# Altium schematic sheet HUB-USB.SchDoc
size 381 x 241 mm; SheetNumber: 2; SheetTotal: 2; SPICEModelCacheYWGEYEZR: <root> / <DocumentId>YWGEYEZR</DocumentId> / </root>
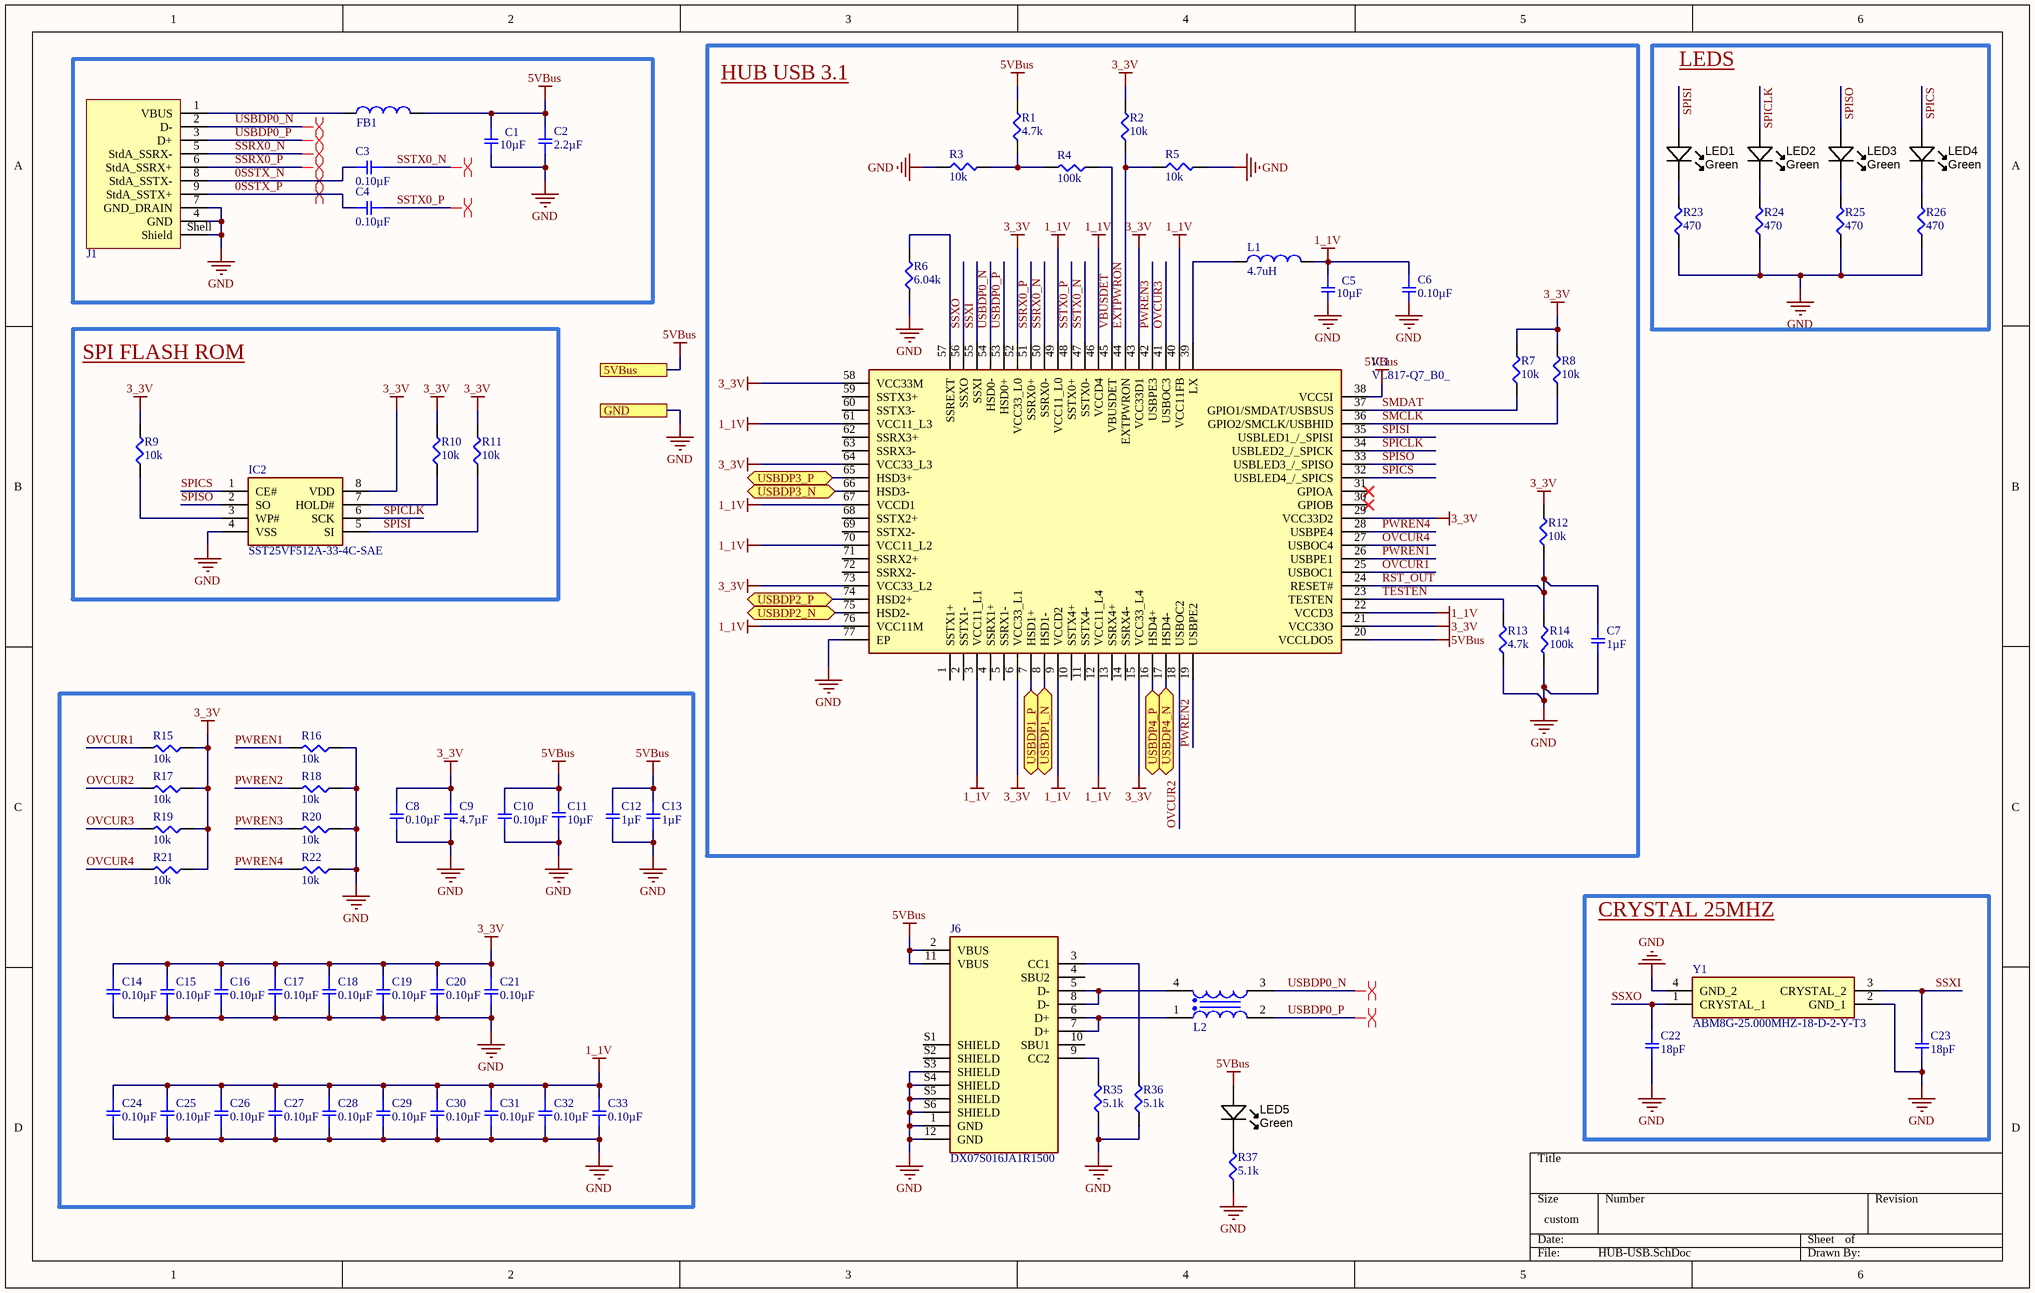
[diagram p0: HUB-USB.SchDoc]

## Parts
C1  10µF  [SMD-0603C]
C2  2.2µF  [SMD-0603C]
C3  0.10µF  [SMD-0402C]
C4  0.10µF  [SMD-0402C]
C5  10µF  [SMD-0603C]
C6  0.10µF  [SMD-0402C]
C7  1µF  [SMD-0402C]
C8  0.10µF  [SMD-0402C]
C9  4.7µF  [SMD-0402C]
C10  0.10µF  [SMD-0402C]
C11  10µF  [SMD-0805C]
C12  1µF  [SMD-0402C]
C13  1µF  [SMD-0402C]
C14  0.10µF  [SMD-0402C]
C15  0.10µF  [SMD-0402C]
C16  0.10µF  [SMD-0402C]
C17  0.10µF  [SMD-0402C]
C18  0.10µF  [SMD-0402C]
C19  0.10µF  [SMD-0402C]
C20  0.10µF  [SMD-0402C]
C21  0.10µF  [SMD-0402C]
C22  18pF  [SMD-0402C]
C23  18pF  [SMD-0402C]
C24  0.10µF  [SMD-0402C]
C25  0.10µF  [SMD-0402C]
C26  0.10µF  [SMD-0402C]
C27  0.10µF  [SMD-0402C]
C28  0.10µF  [SMD-0402C]
C29  0.10µF  [SMD-0402C]
C30  0.10µF  [SMD-0402C]
C31  0.10µF  [SMD-0402C]
C32  0.10µF  [SMD-0402C]
C33  0.10µF  [SMD-0402C]
FB1  10Ohm  [WE-CBA_0402_L1W0.5H0.5_HC]  (value not drawn)
IC1  VL817-Q7_B0_  [QFN40P900X900X90-77N-D]
IC2  SST25VF512A-33-4C-SAE  [SOIC127P600X175-8N]
J1  692122030100  [692122030100]  (value not drawn)
J6  DX07S016JA1R1500  [JAE_DX07S016JA1R1500]
L1  4.7uH  [INDC2518X200N]
L2  90Ohm  [WE-CNSW_1206]  (value not drawn)
LED1  Green  [LED-0603-GREEN]
LED2  Green  [LED-0603-GREEN]
LED3  Green  [LED-0603-GREEN]
LED4  Green  [LED-0603-GREEN]
LED5  Green  [LED-0603-GREEN]
R1  4.7k  [SMD-0402-RES]
R2  10k  [SMD-0402-RES]
R3  10k  [SMD-0402-RES]
R4  100k  [SMD-0402-RES]
R5  10k  [SMD-0402-RES]
R6  6.04k  [SMD-0402-RES]
R7  10k  [SMD-0402-RES]
R8  10k  [SMD-0402-RES]
R9  10k  [SMD-0402-RES]
R10  10k  [SMD-0402-RES]
R11  10k  [SMD-0402-RES]
R12  10k  [SMD-0402-RES]
R13  4.7k  [SMD-0402-RES]
R14  100k  [SMD-0402-RES]
R15  10k  [SMD-0402-RES]
R16  10k  [SMD-0402-RES]
R17  10k  [SMD-0402-RES]
R18  10k  [SMD-0402-RES]
R19  10k  [SMD-0402-RES]
R20  10k  [SMD-0402-RES]
R21  10k  [SMD-0402-RES]
R22  10k  [SMD-0402-RES]
R23  470  [SMD-0402-RES]
R24  470  [SMD-0402-RES]
R25  470  [SMD-0402-RES]
R26  470  [SMD-0402-RES]
R35  5.1k  [SMD-0603-RES]
R36  5.1k  [SMD-0603-RES]
R37  5.1k  [SMD-0603-RES]
Y1  ABM8G-25.000MHZ-18-D-2-Y-T3  [ABM8G16000MHZB4YT]

## Blocks framed on the sheet
HUB USB 3.1: C5-C7 IC1 L1 R1-R8 R12-R14
LEDS: LED1-LED4 R23-R26
SPI FLASH ROM: IC2 R9-R11
CRYSTAL 25MHZ: C22 C23 Y1

## Ports
5VBus (see DSD_Aerobits_RPI4_OLED[3A]), GND (see DSD_Aerobits_RPI4_OLED[3B]), USBDP1_N (bidir, see DSD_Aerobits_RPI4_OLED[3B]), USBDP1_P (bidir, see DSD_Aerobits_RPI4_OLED[3B]), USBDP2_N (bidir, see DSD_Aerobits_RPI4_OLED[3B]), USBDP2_P (bidir, see DSD_Aerobits_RPI4_OLED[3B]), USBDP3_N (bidir, see DSD_Aerobits_RPI4_OLED[3A]), USBDP3_P (bidir, see DSD_Aerobits_RPI4_OLED[3A]), USBDP4_N (bidir, see DSD_Aerobits_RPI4_OLED[3B]), USBDP4_P (bidir, see DSD_Aerobits_RPI4_OLED[3B])

## Nets
1_1V: C5.1 C6.1 C24.1 C25.1 C26.1 C27.1 C28.1 C29.1 C30.1 C31.1 C32.1 C33.1 IC1.3(VCC11_L1) IC1.9(VCCD2) IC1.12(VCC11_L4) IC1.22(VCCD3) IC1.40(VCC11FB) IC1.46(VCCD4) IC1.49(VCC11_L0) IC1.61(VCC11_L3) IC1.67(VCCD1) IC1.70(VCC11_L2) IC1.76(VCC11M) L1.2
3_3V: C8.1 C9.1 C14.1 C15.1 C16.1 C17.1 C18.1 C19.1 C20.1 C21.1 IC1.6(VCC33_L1) IC1.15(VCC33_L4) IC1.21(VCC33O) IC1.29(VCC33D2) IC1.43(VCC33D1) IC1.52(VCC33_L0) IC1.58(VCC33M) IC1.64(VCC33_L3) IC1.73(VCC33_L2) IC2.8(VDD) R2.2 R7.2 R8.2 R9.2 R10.2 R11.2 R12.2 R15.1 R17.1 R19.1 R21.1
5VBus: C1.1 C2.1 C10.1 C11.2 C12.1 C13.1 FB1.2 IC1.20(VCCLDO5) IC1.38(VCC5I) J6.2(VBUS) J6.11(VBUS) LED5.A R1.2 ; port 5VBus
GND: C1.2 C2.2 C5.2 C6.2 C7.2 C8.2 C9.2 C10.2 C11.1 C12.2 C13.2 C14.2 C15.2 C16.2 C17.2 C18.2 C19.2 C20.2 C21.2 C22.2 C23.2 C24.2 C25.2 C26.2 C27.2 C28.2 C29.2 C30.2 C31.2 C32.2 C33.2 IC1.77(EP) IC2.4(VSS) J1.4(GND) J1.7(GND_DRAIN) J1.Shell(Shield) J6.1(GND) J6.12(GND) J6.S3(SHIELD) J6.S4(SHIELD) J6.S5(SHIELD) J6.S6(SHIELD) R3.1 R5.2 R6.1 R13.1 R14.2 R16.1 R18.1 R20.1 R22.1 R23.1 R24.1 R25.1 R26.1 R35.1 R36.1 R37.1 Y1.2(GND_1) Y1.4(GND_2) ; port GND
0SSTX_N: C3.2 J1.8(StdA_SSTX-)
0SSTX_P: C4.2 J1.9(StdA_SSTX+)
EXTPWRON: IC1.44(EXTPWRON) R2.1 R5.1
OVCUR1: IC1.25(USBOC1) R15.2
OVCUR2: IC1.18(USBOC2) R17.2
OVCUR3: IC1.41(USBOC3) R19.2
OVCUR4: IC1.27(USBOC4) R21.2
PWREN1: IC1.26(USBPE1) R16.2
PWREN2: IC1.19(USBPE2) R18.2
PWREN3: IC1.42(USBPE3) R20.2
PWREN4: IC1.28(USBPE4) R22.2
RST_OUT: C7.1 IC1.24(RESET#) R12.1 R14.1
SMCLK: IC1.36(GPIO2/SMCLK/USBHID) R8.1
SMDAT: IC1.37(GPIO1/SMDAT/USBSUS) R7.1
SPICLK: IC1.34(USBLED2_/_SPICK) IC2.6(SCK) LED2.A
SPICS: IC1.32(USBLED4_/_SPICS) IC2.1(CE#) LED4.A
SPISI: IC1.35(USBLED1_/_SPISI) IC2.5(SI) LED1.A R11.1
SPISO: IC1.33(USBLED3_/_SPISO) IC2.2(SO) LED3.A
SSRX0_N: IC1.50(SSRX0-) J1.5(StdA_SSRX-)
SSRX0_P: IC1.51(SSRX0+) J1.6(StdA_SSRX+)
SSTX0_N: C3.1 IC1.47(SSTX0-)
SSTX0_P: C4.1 IC1.48(SSTX0+)
SSXI: C23.1 IC1.55(SSXI) Y1.3(CRYSTAL_2)
SSXO: C22.1 IC1.56(SSXO) Y1.1(CRYSTAL_1)
TESTEN: IC1.23(TESTEN) R13.2
USBDP0_N: IC1.54(HSD0-) J1.2(D-) L2.3
USBDP0_P: IC1.53(HSD0+) J1.3(D+) L2.2
USBDP1_N: IC1.8(HSD1-) ; port USBDP1_N
USBDP1_P: IC1.7(HSD1+) ; port USBDP1_P
USBDP2_N: IC1.75(HSD2-) ; port USBDP2_N
USBDP2_P: IC1.74(HSD2+) ; port USBDP2_P
USBDP3_N: IC1.66(HSD3-) ; port USBDP3_N
USBDP3_P: IC1.65(HSD3+) ; port USBDP3_P
USBDP4_N: IC1.17(HSD4-) ; port USBDP4_N
USBDP4_P: IC1.16(HSD4+) ; port USBDP4_P
VBUSDET: IC1.45(VBUSDET) R4.1
NetFB1_1: FB1.1 J1.1(VBUS)
NetIC1_39: IC1.39(LX) L1.1
NetIC1_57: IC1.57(SSREXT) R6.2
NetIC2_3: IC2.3(WP#) R9.1
NetIC2_7: IC2.7(HOLD#) R10.1
NetJ6_3: J6.3(CC1) R36.2
NetJ6_5: J6.5(D-) J6.8(D-) L2.4
NetJ6_6: J6.6(D+) J6.7(D+) L2.1
NetJ6_9: J6.9(CC2) R35.2
NetLED1_K: LED1.K R23.2
NetLED2_K: LED2.K R24.2
NetLED3_K: LED3.K R25.2
NetLED4_K: LED4.K R26.2
NetLED5_K: LED5.K R37.2
NetR1_1: R1.1 R3.2 R4.2

Not connected (* = marked no-connect by the designer): IC1 1(SSTX1+) 2(SSTX1-) 4(SSRX1+) 5(SSRX1-) 10(SSTX4+) 11(SSTX4-) 13(SSRX4+) 14(SSRX4-) 30(GPIOB)* 31(GPIOA)* 59(SSTX3+) 60(SSTX3-) 62(SSRX3+) 63(SSRX3-) 68(SSTX2+) 69(SSTX2-) 71(SSRX2+) 72(SSRX2-); J6 4(SBU2) 10(SBU1) S1(SHIELD) S2(SHIELD)

## Layout directives
differential pair: 0SSTX_N, 0SSTX_P, SSRX0_N, SSRX0_P, SSTX0_N, SSTX0_P, USBDP0_N, USBDP0_P

## Library data of the parts
C1 C5 = GRT188C81C106ME13D: CAP CER 10UF 16V X6S 0603; Manufacturer: Murata Electronics North America; Factory Stock: 0; Unit Price (USD): 0,46; Minimum Quantity: 1; Tolerance: ±20%; Part Number: GRT188C81C106ME13D; Datasheets: http://search.murata.co.jp/Ceramy/image/img/A01X/G101/ENG/GRT188C81C106ME13-01.pdf; Image: //media.digikey.com/Renders/Murata%20Renders/0603%28LQG18%29.jpg; Digi-Key Part Number: 490-12286-1-ND; Quantity Available: 5439; @ qty: 0; Packaging: Cut Tape (CT); Series: GRT; Part Status: Active; Value: 10µF; Voltage: 16V; Temperature Coefficient: X6S; Operating Temperature: -55°C ~ 105°C; Features: -; Ratings: AEC-Q200; Applications: Automotive; Mounting Type: Surface Mount, MLCC; Package / Case: 0603 (1608 Metric); Size / Dimension: 0.063" L x 0.031" W (1.60mm x 0.80mm); Height - Seated (Max): -; Thickness (Max): 0.035" (0.90mm); Lead Spacing: -; Lead Style: -
C2 = GRT188C81C225KE13D: CAP CER 2.2UF 16V X6S 0603; Manufacturer: Murata Electronics North America; Factory Stock: 0; Unit Price (USD): 0,21; Minimum Quantity: 1; Tolerance: ±10%; Part Number: GRT188C81C225KE13D; Datasheets: http://search.murata.co.jp/Ceramy/image/img/A01X/G101/ENG/GRT188C81C225KE13-01.pdf; Image: //media.digikey.com/Renders/Murata%20Renders/0603%28LQG18%29.jpg; Digi-Key Part Number: 490-12287-1-ND; Quantity Available: 5939; @ qty: 0; Packaging: Cut Tape (CT); Series: GRT; Part Status: Active; Value: 2.2µF; Voltage: 16V; Temperature Coefficient: X6S; Operating Temperature: -55°C ~ 105°C; Features: -; Ratings: AEC-Q200; Applications: Automotive; Mounting Type: Surface Mount, MLCC; Package / Case: 0603 (1608 Metric); Size / Dimension: 0.063" L x 0.031" W (1.60mm x 0.80mm); Height - Seated (Max): -; Thickness (Max): 0.035" (0.90mm); Lead Spacing: -; Lead Style: -
C3 C4 C6 C8 C10 C14-C21 C24-C33 = GCM155R71C104KA55J: CAP CER 0.1UF 16V X7R 0402; Manufacturer: Murata Electronics North America; Factory Stock: 0; Unit Price (USD): 0,1; Minimum Quantity: 1; Tolerance: ±10%; Part Number: GCM155R71C104KA55J; Datasheets: http://www.murata.com/~/media/webrenewal/support/library/catalog/products/capacitor/mlcc/c03e.ashx; Image: //media.digikey.com/Renders/Murata%20Renders/ZRB-SERIES-0402.jpg; Digi-Key Part Number: 490-7998-1-ND; Quantity Available: 618705; @ qty: 0; Packaging: Cut Tape (CT); Series: GCM; Part Status: Active; Value: 0.10µF; Voltage: 16V; Temperature Coefficient: X7R; Operating Temperature: -55°C ~ 125°C; Features: -; Ratings: AEC-Q200; Applications: Automotive; Mounting Type: Surface Mount, MLCC; Package / Case: 0402 (1005 Metric); Size / Dimension: 0.039" L x 0.020" W (1.00mm x 0.50mm); Height - Seated (Max): -; Thickness (Max): 0.022" (0.55mm); Lead Spacing: -; Lead Style: -
C7 C12 C13 = GRM155R61E105MA12D: CAP CER 1UF 25V X5R 0402; Manufacturer: Murata Electronics North America; Factory Stock: 0; Unit Price (USD): 0,1; Minimum Quantity: 1; Tolerance: ±20%; Part Number: GRM155R61E105MA12D; Datasheets: http://www.murata.com/~/media/webrenewal/support/library/catalog/products/capacitor/mlcc/c02e.pdf; Image: //media.digikey.com/Renders/Murata%20Renders/ZRB-SERIES-0402.jpg; Digi-Key Part Number: 490-10018-1-ND; Quantity Available: 32609; @ qty: 0; Packaging: Cut Tape (CT); Series: GRM; Part Status: Active; Value: 1µF; Voltage: 25V; Temperature Coefficient: X5R; Operating Temperature: -55°C ~ 85°C; Features: Derating Recommended; Ratings: -; Applications: General Purpose; Mounting Type: Surface Mount, MLCC; Package / Case: 0402 (1005 Metric); Size / Dimension: 0.039" L x 0.020" W (1.00mm x 0.50mm); Height - Seated (Max): -; Thickness (Max): 0.022" (0.55mm); Lead Spacing: -; Lead Style: -
C9 = ZRB15XR61A475KE01D: CAP CER 4.7UF 10V X5R 0402; Manufacturer: Murata Electronics North America; Factory Stock: 0; Unit Price (USD): 0,28; Minimum Quantity: 1; Tolerance: ±10%; Part Number: ZRB15XR61A475KE01D; Datasheets: http://search.murata.co.jp/Ceramy/image/img/A01X/G101/ENG/ZRB15XR61A475KE01-01.pdf; Image: //media.digikey.com/Renders/Murata%20Renders/ZRB-SERIES-0402.jpg; Digi-Key Part Number: 490-13252-1-ND; Quantity Available: 23076; @ qty: 0; Packaging: Cut Tape (CT); Series: ZRB; Part Status: Active; Value: 4.7µF; Voltage: 10V; Temperature Coefficient: X5R; Operating Temperature: -55°C ~ 85°C; Features: Derating Recommended, Interposer Termination; Ratings: -; Applications: Acoustic Noise Reduction; Mounting Type: Surface Mount, MLCC; Package / Case: 0402 (1005 Metric); Size / Dimension: 0.039" L x 0.020" W (1.00mm x 0.50mm); Height - Seated (Max): -; Thickness (Max): 0.031" (0.80mm); Lead Spacing: -; Lead Style: -
C11 = GRT21BC81C106KE01L: CAP CER 10UF 16V X6S 0805; Manufacturer: Murata Electronics North America; Factory Stock: 0; Unit Price (USD): 0,54; Minimum Quantity: 1; Tolerance: ±10%; Part Number: GRT21BC81C106KE01L; Datasheets: http://search.murata.co.jp/Ceramy/image/img/A01X/G101/ENG/GRT21BC81C106KE01-01.pdf; Image: //media.digikey.com/Renders/Murata%20Renders/GRT%20Series%200805(2012%20Metric).jpg; Digi-Key Part Number: 490-12343-1-ND; Quantity Available: 4300; @ qty: 0; Packaging: Cut Tape (CT); Series: GRT; Part Status: Active; Value: 10µF; Voltage: 16V; Temperature Coefficient: X6S; Operating Temperature: -55°C ~ 105°C; Features: Derating Recommended; Ratings: AEC-Q200; Applications: Automotive; Mounting Type: Surface Mount, MLCC; Package / Case: 0805 (2012 Metric); Size / Dimension: 0.079" L x 0.049" W (2.00mm x 1.25mm); Height - Seated (Max): -; Thickness (Max): 0.057" (1.45mm); Lead Spacing: -; Lead Style: -
C22 C23 = GRM1555C1E180JA01D: CAP CER 18PF 25V NP0 0402; Manufacturer: Murata Electronics North America; Factory Stock: 0; Unit Price (USD): 0,1; Minimum Quantity: 1; Tolerance: ±5%; Temperature Coefficient: C0G, NP0; Part Number: GRM1555C1E180JA01D; Datasheets: http://www.murata.com/~/media/webrenewal/support/library/catalog/products/capacitor/mlcc/c02e.pdf; Image: //media.digikey.com/Renders/Murata%20Renders/ZRB-SERIES-0402.jpg; Digi-Key Part Number: 490-6172-1-ND; Quantity Available: 78161; @ qty: 0; Packaging: Cut Tape (CT); Series: GRM; Part Status: Active; Value: 18pF; Voltage: 25V; Operating Temperature: -55°C ~ 125°C; Features: -; Ratings: -; Applications: General Purpose; Mounting Type: Surface Mount, MLCC; Package / Case: 0402 (1005 Metric); Size / Dimension: 0.039" L x 0.020" W (1.00mm x 0.50mm); Height - Seated (Max): -; Thickness (Max): 0.022" (0.55mm); Lead Spacing: -; Lead Style: -
FB1 = 782423100: WE-CBA SMT EMI Suppression Ferrite Bead, size 0402, 10Ohm, 1.5A; Manufacturer: Wurth Elektronik; Case/Size Code: 0402; DC Resistance Max: 0.03Ohm; Impedance Max: 17Ohm; Type: High Current; Manufacturer Part Number: 782423100; Category: Ferrites for PCB Assembly; Match Code: WE-CBA; ComponentLink1Description: Website Link; ComponentLink1URL: https://www.we-online.com/redexpert/article/782423100?ad; ComponentLink2Description: Datasheet Link; ComponentLink2URL: https://www.we-online.com/redexpert/spec/782423100?ad; Mount: Surface Mount; Operating Temperature Max: 125°C; Operating Temperature Min: -55°C; Packaging: Tape and Reel; Length: 1mm; Width: 0.5mm; Height: 0.5mm; Automotive: Yes; Impedance @100MHz: 10Ohm; Rated Current: 1.5A
IC1 = VL817-Q7_B0_: Integrated Circuit; Manufacturer_Name: VIA; Manufacturer_Part_Number: VL817-Q7(B0); Datasheet Link: https://item.szlcsc.com/210703.html; Height: 0.9mm
IC2 = SST25VF512A-33-4C-SAE: Integrated Circuit; Manufacturer_Name: Microchip; Datasheet Link: http://ww1.microchip.com/downloads/en/DeviceDoc/25090A.pdf; Height: 1.75mm; Manufacturer_Part_Number: SST25VF512A-33-4C-SAE; Mouser Part Number: 804-25VF512A3CSAE; Mouser Price/Stock: https://www.mouser.co.uk/ProductDetail/Microchip-Technology/SST25VF512A-33-4C-SAE?qs=sPPKN8MmjErx4W822Eh6pg%3D%3D; Arrow Part Number: SST25VF512A-33-4C-SAE; Arrow Price/Stock: https://www.arrow.com/en/products/sst25vf512a-33-4c-sae/microchip-technology?region=nac
J1 = 692122030100: WR-COM USB 3.0 Type A Horizontal SMT; Manufacturer: Wurth Elektronik; Match Code: WR-USB; Gender: Receptacle; Interface Type: Type A; Number of Ports: 1; Rated Current: 1.8A; Working Voltage: 30V (AC); Manufacturer Part Number: 692122030100; Category: Input/Output Connectors; ComponentLink1Description: Website Link; ComponentLink1URL: https://www.we-online.com/redexpert/article/692122030100?ad; ComponentLink2Description: Datasheet Link; ComponentLink2URL: https://www.we-online.com/redexpert/spec/692122030100?ad; Mount: Surface Mount; Operating Temperature Max: 85°C; Operating Temperature Min: -20°C; Packaging: Tape and Reel; Application: USB 3.0; Number of Pins: 9; Orientation: Horizontal
J6 = DX07S016JA1R1500: USB-C (USB TYPE-C) USB 2.0 Receptacle Connector 24 (16+8 Dummy) Position Surface Mount, Right Angle; Through Hole; Package: None; Value: *; Price: None; MP: DX07S016JA1R1500; Availability: Unavailable
L1 = CB2518T4R7M: Ind Power Chip Wirewound 4.7uH 20% 7.96MHz Ferrite 1.1A 1007 T/R; Price: None; MP: CB2518T4R7M; Value: *; Availability: Unavailable; Package: None
L2 = 744232090: WE-CNSW SMT Common Mode Line Filter, size 1206, 90Ohm, 0.111uH, 50V; Manufacturer: Wurth Elektronik; Case/Size Code: 1206; DC Resistance Max: 0.3Ohm; Insulation Test Voltage: 125VAC; Rated Current: 0.37A; Winding Style: bifiliar; ComponentLink1Description: Manufacturer Link; ComponentLink1URL: https://www.we-online.com/redexpert/article/744232090?ad; ComponentLink2Description: Datasheet; ComponentLink2URL: https://www.we-online.com/redexpert/spec/744232090?ad; Category: Common Mode Chokes; Match Code: WE-CNSW; Manufacturer Part Number: 744232090; Mount: Surface Mount; Operating Temperature Max: 125°C; Operating Temperature Min: -40°C; Packaging: Tape and Reel; Length: 3.2mm; Width: 1.6mm; Height: 1.8mm; Impedance @100MHz: 90Ohm; Inductance: 0.111uH; Rated Voltage: 50V
LED1-LED4 = LED_SMD_Green_0603_525nm_350mcd: LED 0603 SMD Green 525nm 350mcd 20mA; Manufacturer 1: Kingbright; Manufacturer Part Number 1: APT1608ZGCK; Material: InGaN; Ratings: 200mcd min; 350 mcd typ @ 20mA; Voltage - Forward (Vf) @ 10mA: 3.1V; Viewing Angle: 120°; Lens Style/Size: Rectangle with Flat Top, 1.2mm x 0.8mm; Voltage - Forward (Vf) @ 20mA: 3.3V; SCDType: source; Package / Case: 0603 (1608 metric); Color: Green; Current - Test: 20mA; Manufacturer 2: Kingbright Company LLC; Manufacturer Part Number 2: APT1608-WAP24; Supplier 1: Mouser; Supplier Part Number 1: 604-APT1608ZGCK; ComponentLink1URL: http://www.mouser.com/ds/2/216/APT1608ZGCK-262051.pdf; ComponentLink1Description: http://www.mouser.com/ds/2/216/APT1608ZGCK-262051.pdf; ComponentLink2Description: APT1608-WAP24 Datasheet; ComponentLink2URL: \\SVFI2\PBLShare\Eng\Electrical Engineering\Hardware\Altium\Libraries and Templates\Unreleased Components\Part Number Request 2013-10-02\APT1608-WAP24(Ver.1B).pdf
LED5 = LED_SMD_Green_0603_570nm: LED 0603 SMD Green 570nm 50mcd 20mA; Manufacturer 1: Kingbright Company LLC; Manufacturer Part Number 1: APT1608CGCK; Material: AlGaInP; Ratings: 20mcd min; 50 mcd typ; 570 nm; Voltage - Forward (Vf) Typ: 2.1V; Viewing Angle: 120°; Lens Style/Size: Rectangle with Flat Top, 1.1mm x 0.8mm; Voltage - Forward (Vf) @ 10mA: 2.0V; SCDType: source; Wavelength - Peak: 574nm; Lens Type: Clear; Package / Case: 0603 (1608 metric); Color: Green; Current - Test: 20mA; Supplier 1: Digi-Key; Supplier Part Number 1: 754-1116-1-ND; RoHS 1: RoHS Compliant; Wavelength - Dominant: 570nm; ComponentLink1URL: http://www.us.kingbright.com/images/catalog/SPEC/APT1608CGCK.pdf; ComponentLink1Description: http://www.us.kingbright.com/images/catalog/SPEC/APT1608CGCK.pdf
R1 R13 = ERJ-2RKF4701X: RES SMD 4.7K OHM 1% 1/10W 0402; Manufacturer: Panasonic Electronic Components; Factory Stock: 0; Unit Price (USD): 0.00496; @ qty: 1500; Minimum Quantity: 1; Power (Watts): 0.1W, 1/10W; Temperature Coefficient: ±100ppm/°C; Part Number: ERJ-2RKF4701X; Datasheets: http://industrial.panasonic.com/www-cgi/jvcr13pz.cgi?E+PZ+3+AOA0002+ERJ2RKF4701X+7+WW; Image: //media.digikey.com/Photos/Panasonic%20Photos/ERJ-PA2-Series.jpg; Digi-Key Part Number: P4.70KLCT-ND; Quantity Available: 1881807; Packaging: Cut Tape (CT); Series: ERJ; Part Status: Active; Value: 4.7k; Tolerance: ±1%; Composition: Thick Film; Features: Automotive AEC-Q200; Operating Temperature: -55°C ~ 155°C; Package / Case: 0402 (1005 Metric); Supplier Device Package: 0402; Size / Dimension: 0.039" L x 0.020" W (1.00mm x 0.50mm); Height - Seated (Max): 0.016" (0.40mm); Number of Terminations: 2; Failure Rate: -
R2 R3 R5 R7-R12 R15-R22 = ERJ-2RKF1002X: RES SMD 10K OHM 1% 1/10W 0402; Manufacturer: Panasonic Electronic Components; Factory Stock: 0; Unit Price (USD): 0.00496; @ qty: 1500; Minimum Quantity: 1; Power (Watts): 0.1W, 1/10W; Temperature Coefficient: ±100ppm/°C; Part Number: ERJ-2RKF1002X; Datasheets: http://industrial.panasonic.com/www-cgi/jvcr13pz.cgi?E+PZ+3+AOA0002+ERJ2RKF1002X+7+WW; Image: //media.digikey.com/Photos/Panasonic%20Photos/ERJ-PA2-Series.jpg; Digi-Key Part Number: P10.0KLCT-ND; Quantity Available: 9922786; Packaging: Cut Tape (CT); Series: ERJ; Part Status: Active; Value: 10k; Tolerance: ±1%; Composition: Thick Film; Features: Automotive AEC-Q200; Operating Temperature: -55°C ~ 155°C; Package / Case: 0402 (1005 Metric); Supplier Device Package: 0402; Size / Dimension: 0.039" L x 0.020" W (1.00mm x 0.50mm); Height - Seated (Max): 0.016" (0.40mm); Number of Terminations: 2; Failure Rate: -
R4 R14 = ERJ-2RKF1003X: RES SMD 100K OHM 1% 1/10W 0402; Manufacturer: Panasonic Electronic Components; Factory Stock: 0; Unit Price (USD): 0.00496; @ qty: 1500; Minimum Quantity: 1; Power (Watts): 0.1W, 1/10W; Temperature Coefficient: ±100ppm/°C; Part Number: ERJ-2RKF1003X; Datasheets: http://industrial.panasonic.com/www-cgi/jvcr13pz.cgi?E+PZ+3+AOA0002+ERJ2RKF1003X+7+WW; Image: //media.digikey.com/Photos/Panasonic%20Photos/ERJ-PA2-Series.jpg; Digi-Key Part Number: P100KLCT-ND; Quantity Available: 2645965; Packaging: Cut Tape (CT); Series: ERJ; Part Status: Active; Value: 100k; Tolerance: ±1%; Composition: Thick Film; Features: Automotive AEC-Q200; Operating Temperature: -55°C ~ 155°C; Package / Case: 0402 (1005 Metric); Supplier Device Package: 0402; Size / Dimension: 0.039" L x 0.020" W (1.00mm x 0.50mm); Height - Seated (Max): 0.016" (0.40mm); Number of Terminations: 2; Failure Rate: -
R6 = ERJ-2RKF6041X: RES SMD 6.04K OHM 1% 1/10W 0402; Manufacturer: Panasonic Electronic Components; Factory Stock: 0; Unit Price (USD): 0.00496; @ qty: 1500; Minimum Quantity: 1; Power (Watts): 0.1W, 1/10W; Temperature Coefficient: ±100ppm/°C; Part Number: ERJ-2RKF6041X; Datasheets: http://industrial.panasonic.com/www-cgi/jvcr13pz.cgi?E+PZ+3+AOA0002+ERJ2RKF6041X+7+WW; Image: //media.digikey.com/Photos/Panasonic%20Photos/ERJ-PA2-Series.jpg; Digi-Key Part Number: P6.04KLCT-ND; Quantity Available: 368877; Packaging: Cut Tape (CT); Series: ERJ; Part Status: Active; Value: 6.04k; Tolerance: ±1%; Composition: Thick Film; Features: Automotive AEC-Q200; Operating Temperature: -55°C ~ 155°C; Package / Case: 0402 (1005 Metric); Supplier Device Package: 0402; Size / Dimension: 0.039" L x 0.020" W (1.00mm x 0.50mm); Height - Seated (Max): 0.016" (0.40mm); Number of Terminations: 2; Failure Rate: -
R23-R26 = ERJ-2GEJ471X: RES SMD 470 OHM 5% 1/10W 0402; Manufacturer: Panasonic Electronic Components; Factory Stock: 0; Unit Price (USD): 0.00350; @ qty: 1500; Minimum Quantity: 1; Power (Watts): 0.1W, 1/10W; Temperature Coefficient: ±200ppm/°C; Part Number: ERJ-2GEJ471X; Datasheets: http://industrial.panasonic.com/www-cgi/jvcr13pz.cgi?E+PZ+3+AOA0001+ERJ2GEJ471X+7+WW; Image: //media.digikey.com/Photos/Panasonic%20Photos/ERJ-PA2-Series.jpg; Digi-Key Part Number: P470JCT-ND; Quantity Available: 870271; Packaging: Cut Tape (CT); Series: ERJ; Part Status: Active; Value: 470; Tolerance: ±5%; Composition: Thick Film; Features: Automotive AEC-Q200; Operating Temperature: -55°C ~ 155°C; Package / Case: 0402 (1005 Metric); Supplier Device Package: 0402; Size / Dimension: 0.039" L x 0.020" W (1.00mm x 0.50mm); Height - Seated (Max): 0.016" (0.40mm); Number of Terminations: 2; Failure Rate: -
R35-R37 = ERJ-3EKF5101V: RES SMD 5.1K OHM 1% 1/10W 0603; Manufacturer: Panasonic Electronic Components; Factory Stock: 0; Unit Price (USD): 0.00379; @ qty: 1500; Minimum Quantity: 1; Power (Watts): 0.1W, 1/10W; Temperature Coefficient: ±100ppm/°C; Part Number: ERJ-3EKF5101V; Datasheets: http://industrial.panasonic.com/www-cgi/jvcr13pz.cgi?E+PZ+3+AOA0002+ERJ3EKF5101V+7+WW; Image: //media.digikey.com/Photos/Panasonic%20Photos/MFG_ERJ-P6W%20Series.jpg; Digi-Key Part Number: P5.10KHCT-ND; Quantity Available: 159646; Packaging: Cut Tape (CT); Series: ERJ; Part Status: Active; Value: 5.1k; Tolerance: ±1%; Composition: Thick Film; Features: Automotive AEC-Q200; Operating Temperature: -55°C ~ 155°C; Package / Case: 0603 (1608 Metric); Supplier Device Package: 0603; Size / Dimension: 0.063" L x 0.031" W (1.60mm x 0.80mm); Height - Seated (Max): 0.022" (0.55mm); Number of Terminations: 2; Failure Rate: -
Y1 = ABM8G-25.000MHZ-18-D-2-Y-T3: Crystal or Oscillator; Manufacturer_Name: ABRACON; Datasheet Link: https://abracon.com/Resonators/ABM8G.pdf; Height: 1mm; Manufacturer_Part_Number: ABM8G-25.000MHZ-18-D-2-Y-T3